# EasyEDA Pro project ProPrj_LowFreqInverter_2025-11-08.epro

# Schematic Schematic1
Board Name: Board1; Create Date: 2025-08-09; Page Name: P1; Project Name: LowFreqInverter; Schematic Name: Schematic1; Update Date: 2025-08-09; Company: Vijay Satheesh; Page Size: A4; Version: V1.0
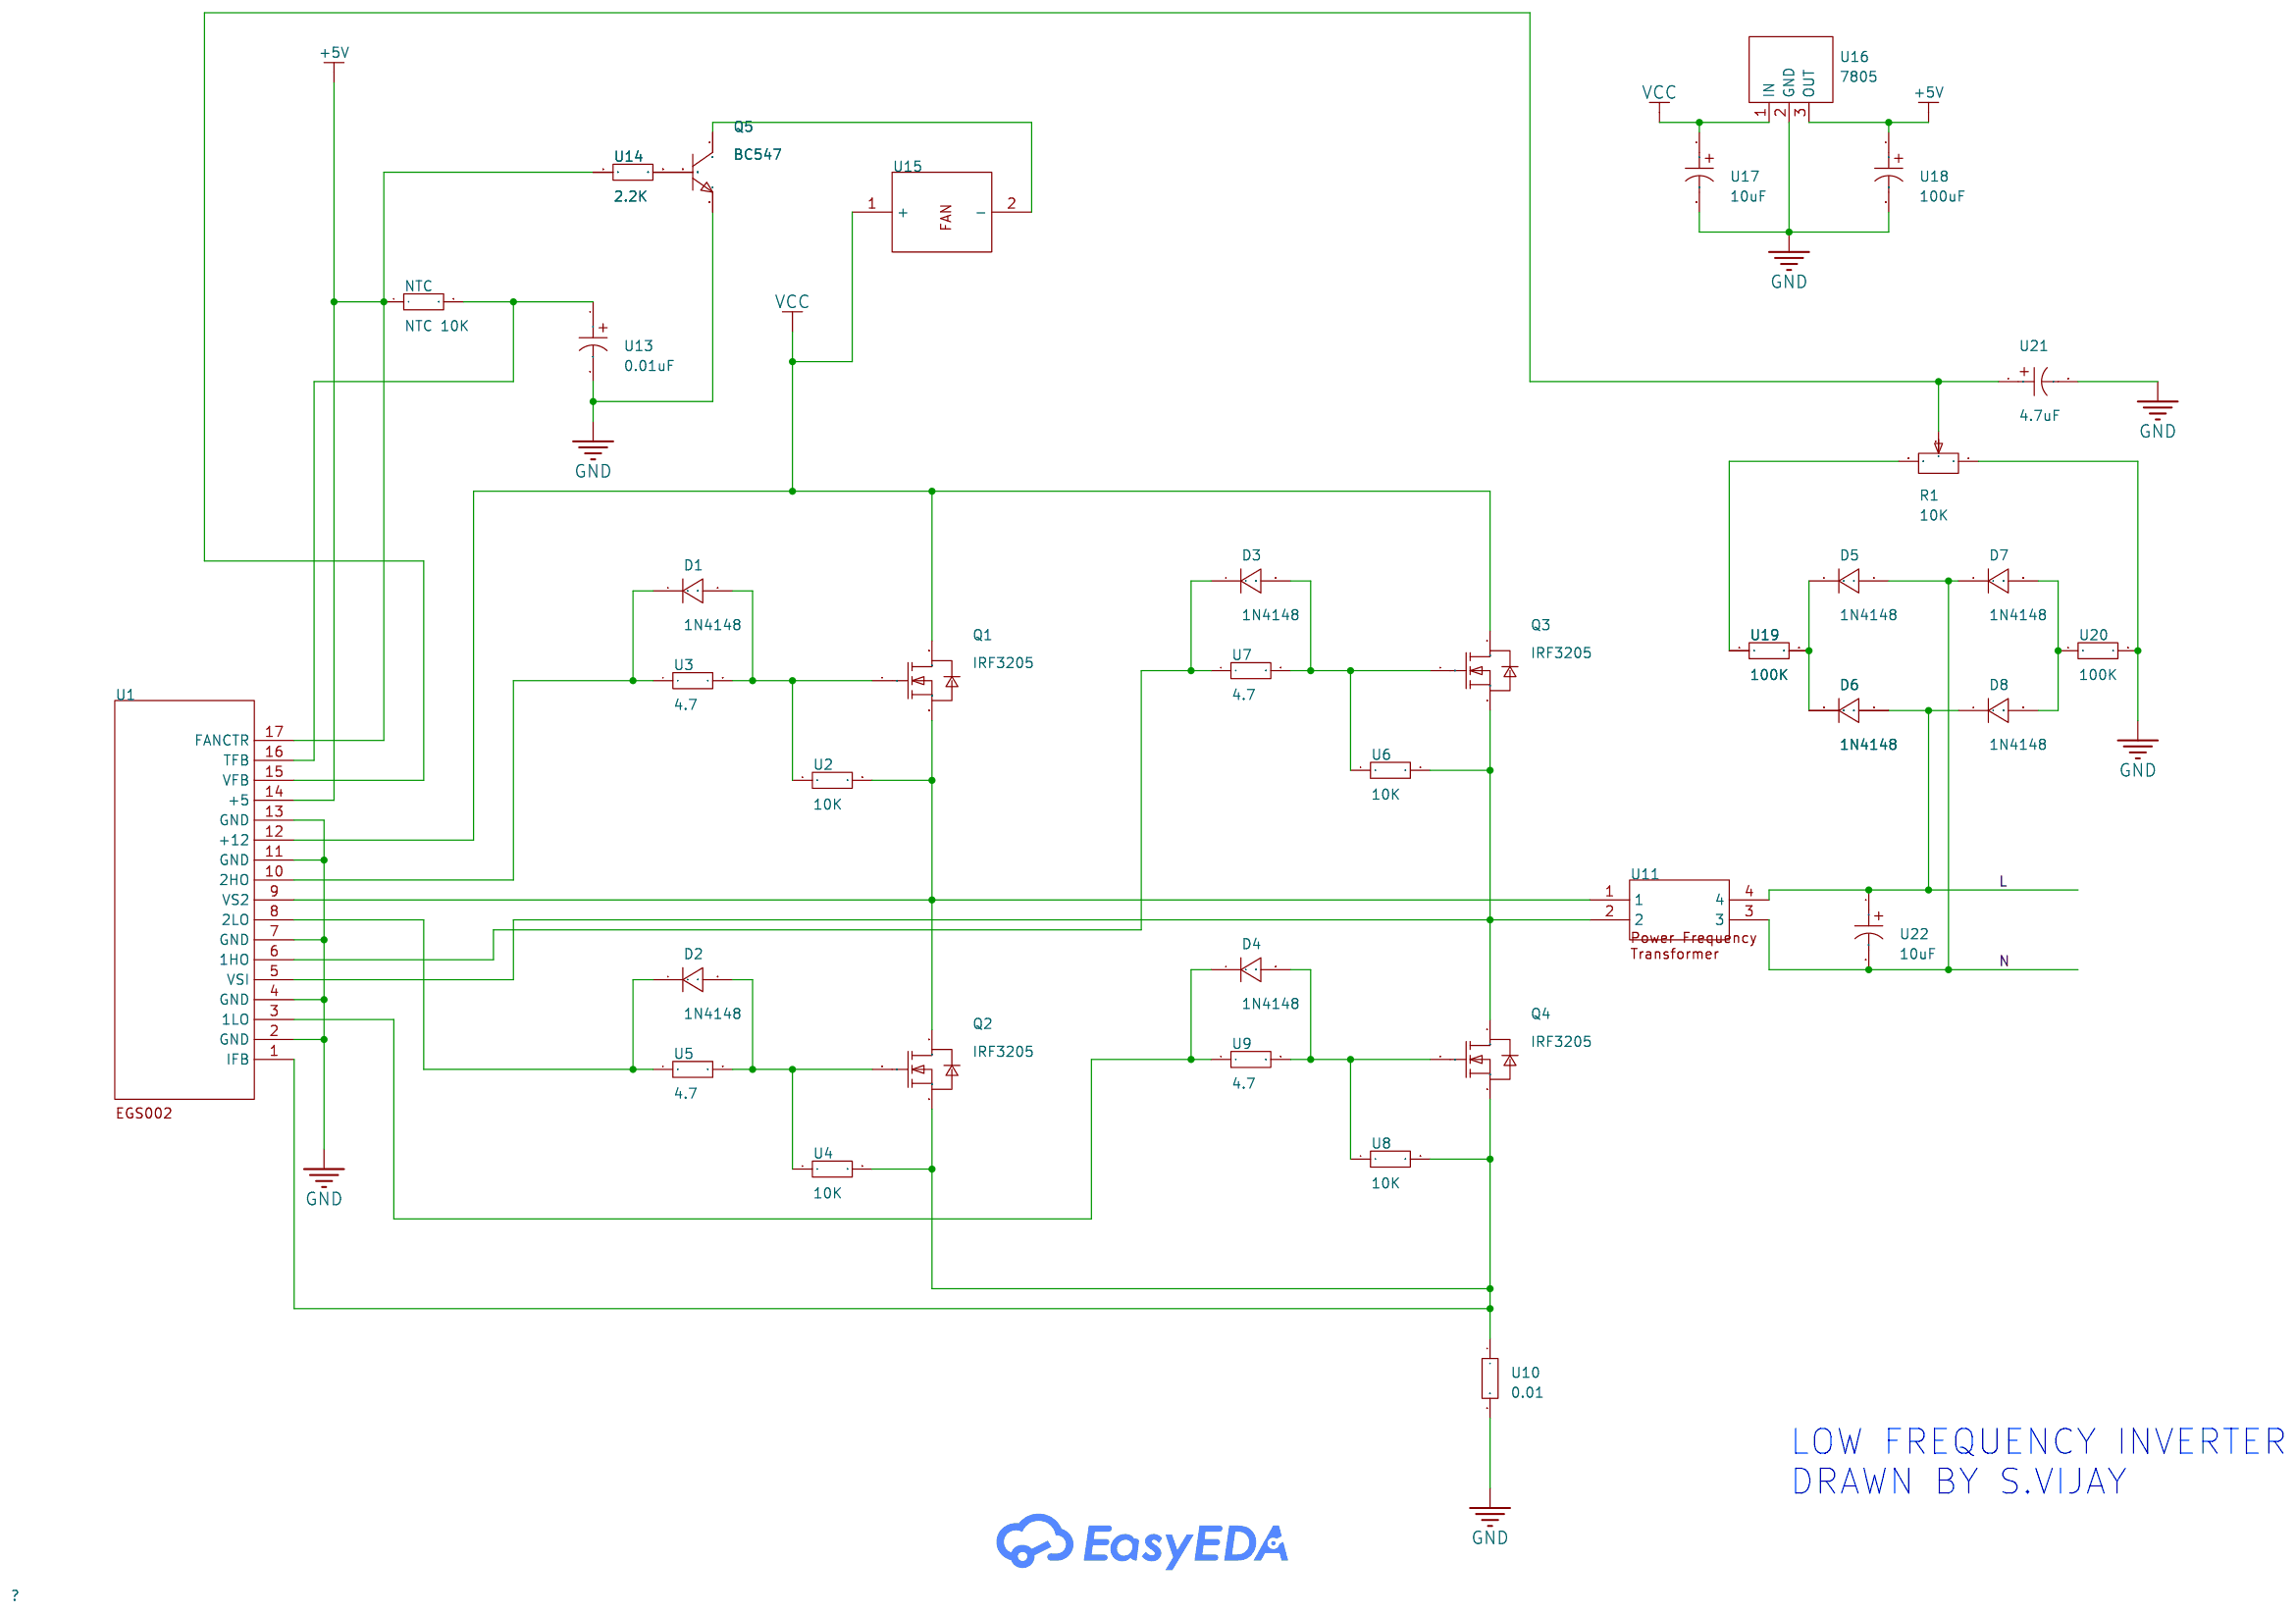
[diagram p0: schematic sheet]

## Parts
D1  1N4148  [DO-35_BD2.0-L4.0-P8.0-D0.5-RD]
D2  1N4148  [DO-35_BD2.0-L4.0-P8.0-D0.5-RD]
D3  1N4148  [DO-35_BD2.0-L4.0-P8.0-D0.5-RD]
D4  1N4148  [DO-35_BD2.0-L4.0-P8.0-D0.5-RD]
D5  1N4148  [DO-35_BD2.0-L4.0-P8.0-D0.5-RD]
D6  1N4148  [DO-35_BD2.0-L4.0-P8.0-D0.5-RD]
D7  1N4148  [DO-35_BD2.0-L4.0-P8.0-D0.5-RD]
D8  1N4148  [DO-35_BD2.0-L4.0-P8.0-D0.5-RD]
NTC  NTC 10K  [RES-TH_BD2.3-L6.5-P10.50-D0.5]
Q1  IRF3205  [TO-220-3_L10.0-W4.6-P2.54-L]
Q2  IRF3205  [TO-220-3_L10.0-W4.6-P2.54-L]
Q3  IRF3205  [TO-220-3_L10.0-W4.6-P2.54-L]
Q4  IRF3205  [TO-220-3_L10.0-W4.6-P2.54-L]
Q5  BC547  [TO-92-3_L4.9-W3.7-P1.27-L]
R1  10K  [RES-ADJ-TH_3296W]
U1  -  [EGS002]
U2  10K  [RES-TH_BD2.3-L6.5-P10.50-D0.5]
U3  4.7  [RES-TH_BD2.3-L6.5-P10.50-D0.5]
U4  10K  [RES-TH_BD2.3-L6.5-P10.50-D0.5]
U5  4.7  [RES-TH_BD2.3-L6.5-P10.50-D0.5]
U6  10K  [RES-TH_BD2.3-L6.5-P10.50-D0.5]
U7  4.7  [RES-TH_BD2.3-L6.5-P10.50-D0.5]
U8  10K  [RES-TH_BD2.3-L6.5-P10.50-D0.5]
U9  4.7  [RES-TH_BD2.3-L6.5-P10.50-D0.5]
U10  0.01  [RES-TH_BD2.3-L6.5-P10.50-D0.5]
U11  -  [Power Frequency Transformer]
U13  0.01uF  [CAP-TH_BD5.0-P2.00-D0.6-FD]
U14  2.2K  [RES-TH_BD2.3-L6.5-P10.50-D0.5]
U15  -  [FAN]
U16  7805  [TO-220-3_L10.2-W4.5-P2.54-L]
U17  10uF  [CAP-TH_BD5.0-P2.00-D0.6-FD]
U18  100uF  [CAP-TH_BD5.0-P2.00-D0.6-FD]
U19  100K  [RES-TH_BD2.3-L6.5-P10.50-D0.5]
U20  100K  [RES-TH_BD2.3-L6.5-P10.50-D0.5]
U21  4.7uF  [CAP-TH_BD5.0-P2.00-D0.6-FD]
U22  10uF  [CAP-TH_BD5.0-P2.00-D0.6-FD]

## Library data of the parts
D1-D8 = 1N4148: Diode Configuration: Forward Voltage (Vf@If):- Reverse Voltage (Vr):- Average Rectified Current (Io):- Reverse Leakage Current:-; Supplier Part: C13769; Supplier Footprint: DO-35; JLCPCB Part Class: Extended Part; Supplier: LCSC
NTC U2-U10 U14 U19 U20 = RES1/4W47K: Supplier Part: C9900002914; Supplier Footprint: RES-TH; JLCPCB Part Class: Extended Part; Supplier: LCSC
Q1-Q4 = IRF3205: Type:1 N-channel Drain to Source Voltage:55V Current - Continuous Drain(Id):110A RDS(on):7.2mΩ@10V,40A Pd - Power Dissipation:210W Gate Threshold Voltage (Vgs(th)@Id):4V Gate Charge(Qg):146nC@10V Input Capacitance(Ciss@Vds):3.247nF@25V Reverse Transfer Ca; LCSC Part Name: 1个N沟道 耐压:55V 电流:110A; Supplier Part: C19189952; Manufacturer: minos(迈诺斯); Supplier Footprint: TO-220; Datasheet: https://atta.szlcsc.com/upload/public/pdf/source/20231108/C93D91AA19AF5D739BAF624DC44DB8C4.pdf; Supplier: LCSC; Type: 1 N-channel; Drain to Source Voltage: 55V; Current - Continuous Drain(Id): 110A; RDS(on): 7.2mΩ@10V,40A; Pd - Power Dissipation: 210W; Gate Threshold Voltage (Vgs(th)@Id): 4V; Gate Charge(Qg): 146nC@10V; Input Capacitance(Ciss@Vds): 3.247nF@25V; Reverse Transfer Capacitance (Crss@Vds): 211pF@25V; Operating Temperature: -55℃~+175℃
Q5 = BC547: type:NPN Current - Collector(Ic):100mA Collector - Emitter Voltage VCEO:45V Pd - Power Dissipation:625mW DC Current Gain:800@5V,2mA DC Current Gain:800@5V,2mA Transition frequency(fT):150MHz Current - Collector Cutoff:100nA Vce Saturation(VCE(sat)):300mV@; Supplier Part: C47089404; Manufacturer: CJ(江苏长电/长晶); Supplier Footprint: TO-92; JLCPCB Part Class: Extended Part; Datasheet: https://atta.szlcsc.com/upload/public/pdf/source/20250402/F61E63731C76602D8AF3C7B55B416117.pdf; Supplier: LCSC; type: NPN; Current - Collector(Ic): 100mA; Collector - Emitter Voltage VCEO: 45V; Pd - Power Dissipation: 625mW; DC Current Gain: 800@5V,2mA; Transition frequency(fT): 150MHz; Current - Collector Cutoff: 100nA; Vce Saturation(VCE(sat)): 300mV@100mA,5mA; Operating Temperature: -55℃~+150℃; Emitter-Base Voltage(Vebo): 6V; Number: 1 NPN
R1 = 3296W-2K: Supplier Part: C9900022608; Supplier Footprint: RES-ADJ-TH; JLCPCB Part Class: Extended Part; Supplier: LCSC
U1 = EGS002
U11 = Power Frequency Transformer
U13 U17 U18 U21 U22 = CE2.5MM-4.7uf 50V: Supplier Part: C9900010368; Supplier Footprint: CAP-TH; JLCPCB Part Class: Extended Part; Supplier: LCSC
U15 = FAN
U16 = 7805: Supplier Part: C2941265; Supplier Footprint: TO-220; Supplier: LCSC

## Nets
+5V: NTC.1 U1.14(+5) U1.17(FANCTR) U14.1 U16.3(OUT) U18.1
GND: Q5.3(E) R1.1 U1.2(GND) U1.4(GND) U1.7(GND) U1.11(GND) U1.13(GND) U10.2 U13.2 U16.2(GND) U17.2 U18.2 U20.2 U21.2
VCC: Q1.2(D) Q3.2(D) U1.12(+12) U15.1(+) U16.1(IN) U17.1
L: D6.2 D8.1 U11.4 U22.1
N: D5.2 D7.1 U11.3 U22.2
$1N413: D1.2 Q1.1(G) U2.1 U3.2
$1N428: D1.1 U1.10(2HO) U3.1
$1N449: Q1.3(S) Q2.2(D) U1.9(VS2) U2.2 U11.1
$1N596: D2.2 Q2.1(G) U4.1 U5.2
$1N603: D2.1 U1.8(2LO) U5.1
$1N750: D3.2 Q3.1(G) U6.1 U7.2
$1N757: D3.1 U1.6(1HO) U7.1
$1N761: Q3.3(S) Q4.2(D) U1.5(VSI) U6.2 U11.2
$1N904: D4.2 Q4.1(G) U8.1 U9.2
$1N911: D4.1 U1.3(1LO) U9.1
$1N915: Q2.3(S) Q4.3(S) U1.1(IFB) U4.2 U8.2 U10.1
$1N1323: NTC.2 U1.16(TFB) U13.1
$1N1552: Q5.2(B) U14.2
$1N1627: Q5.1(C) U15.2(-)
$1N2099: D5.1 D6.1 U19.2
$1N2104: D7.2 D8.2 U20.1
$1N2266: R1.3 U19.1
$1N2327: R1.2 U1.15(VFB) U21.1

## Notes on the sheet
- LOW FREQUENCY INVERTER
  DRAWN BY S.VIJAY

# Board PCB4
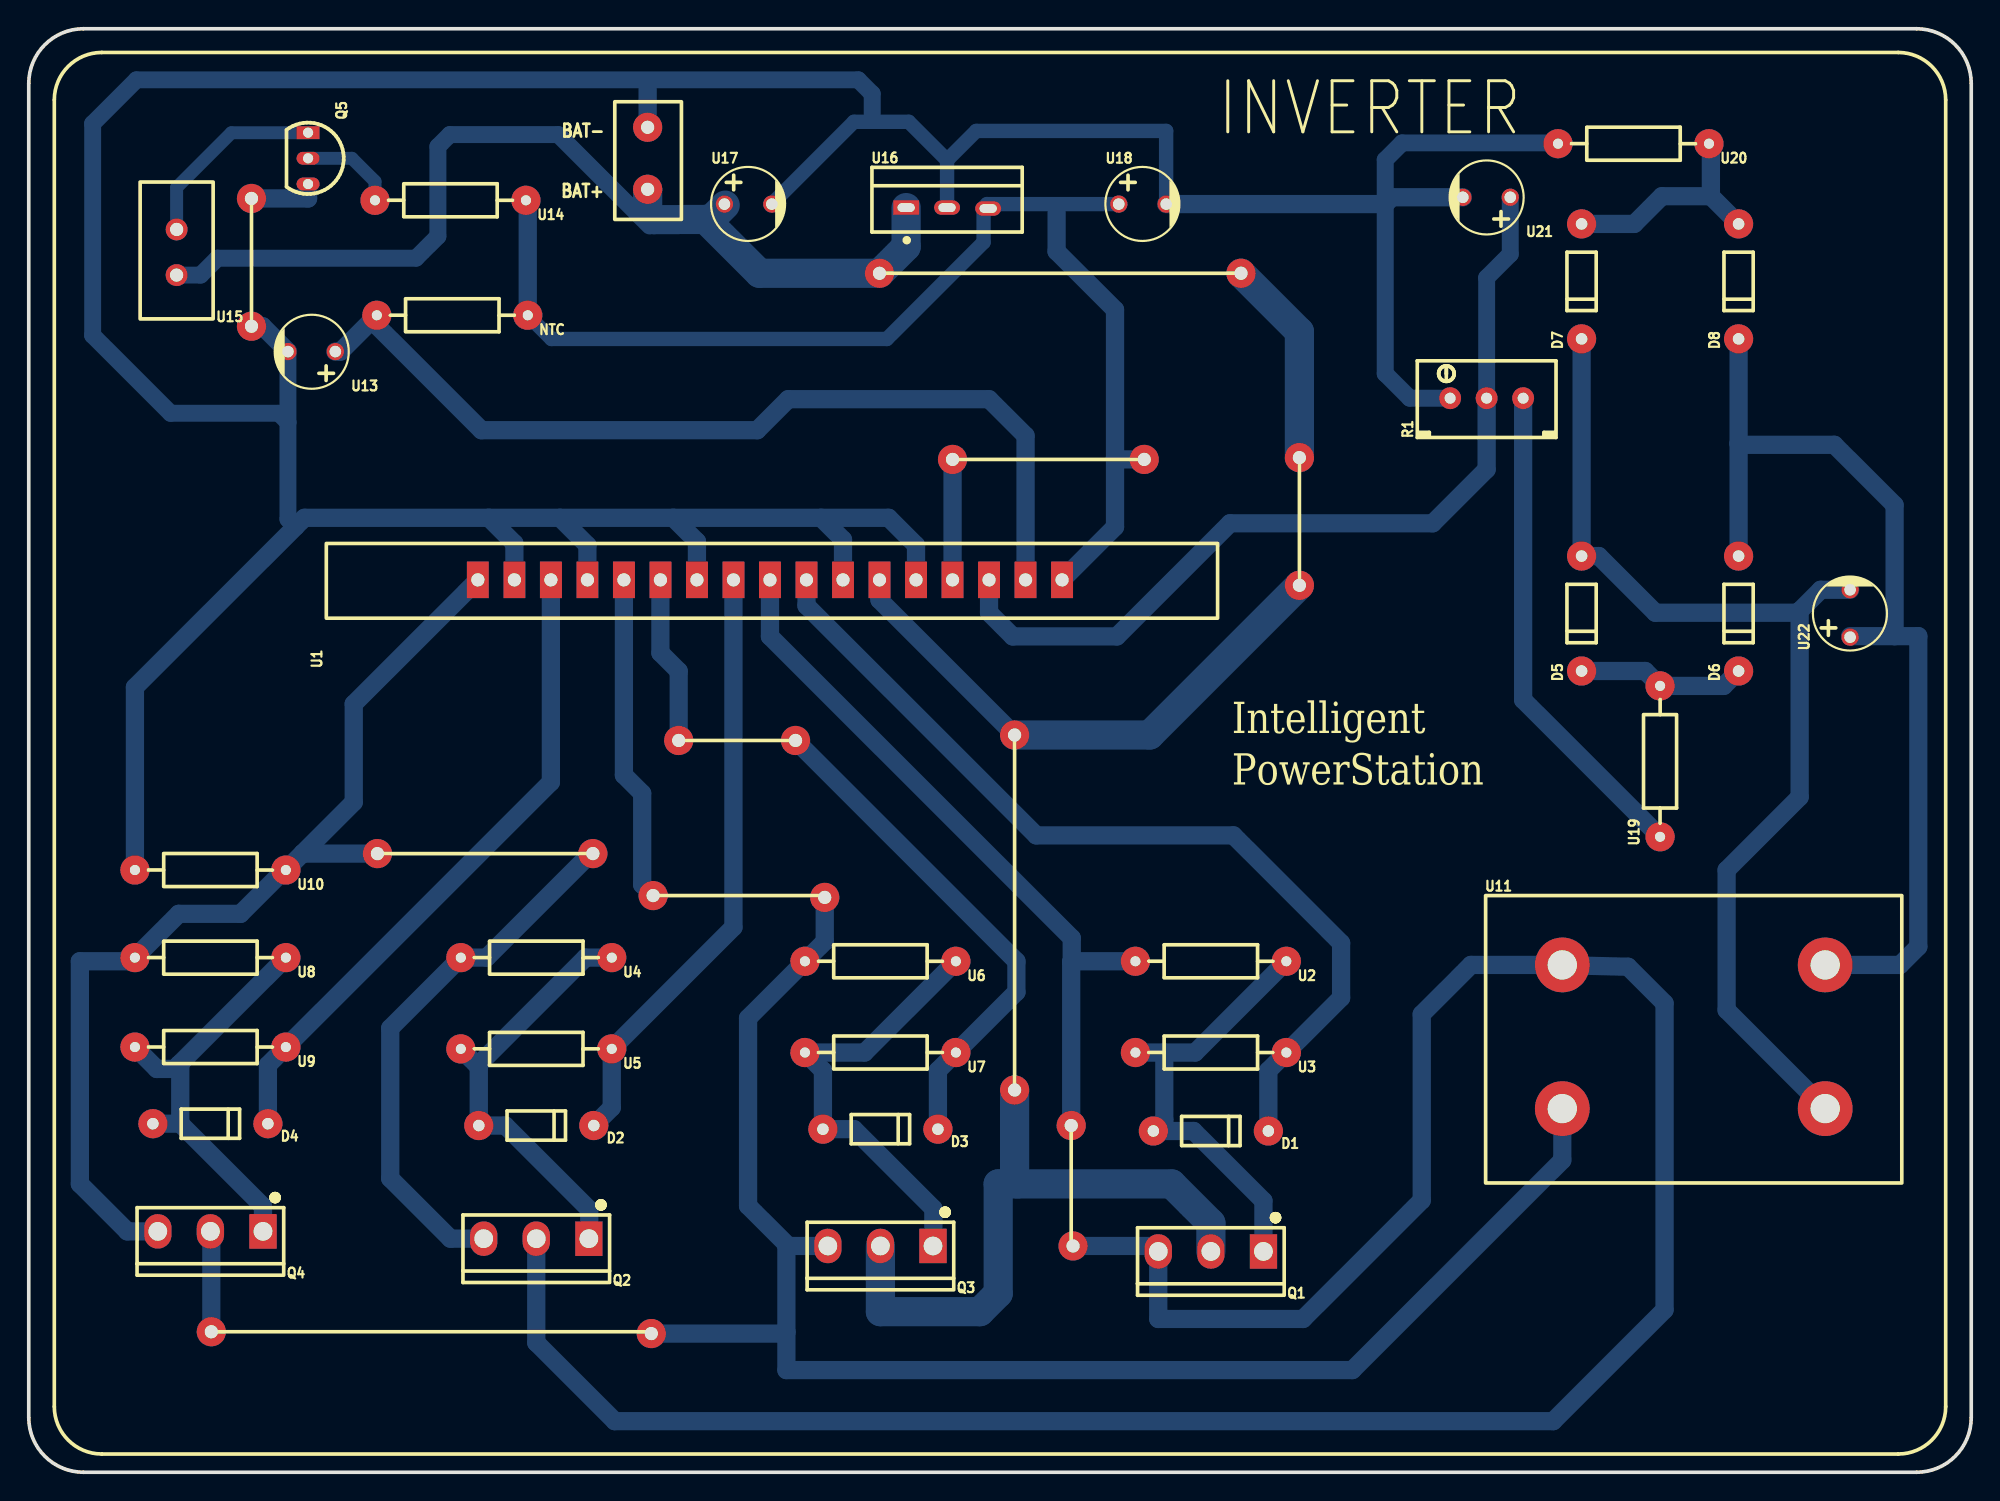
[diagram p1: board, top side]
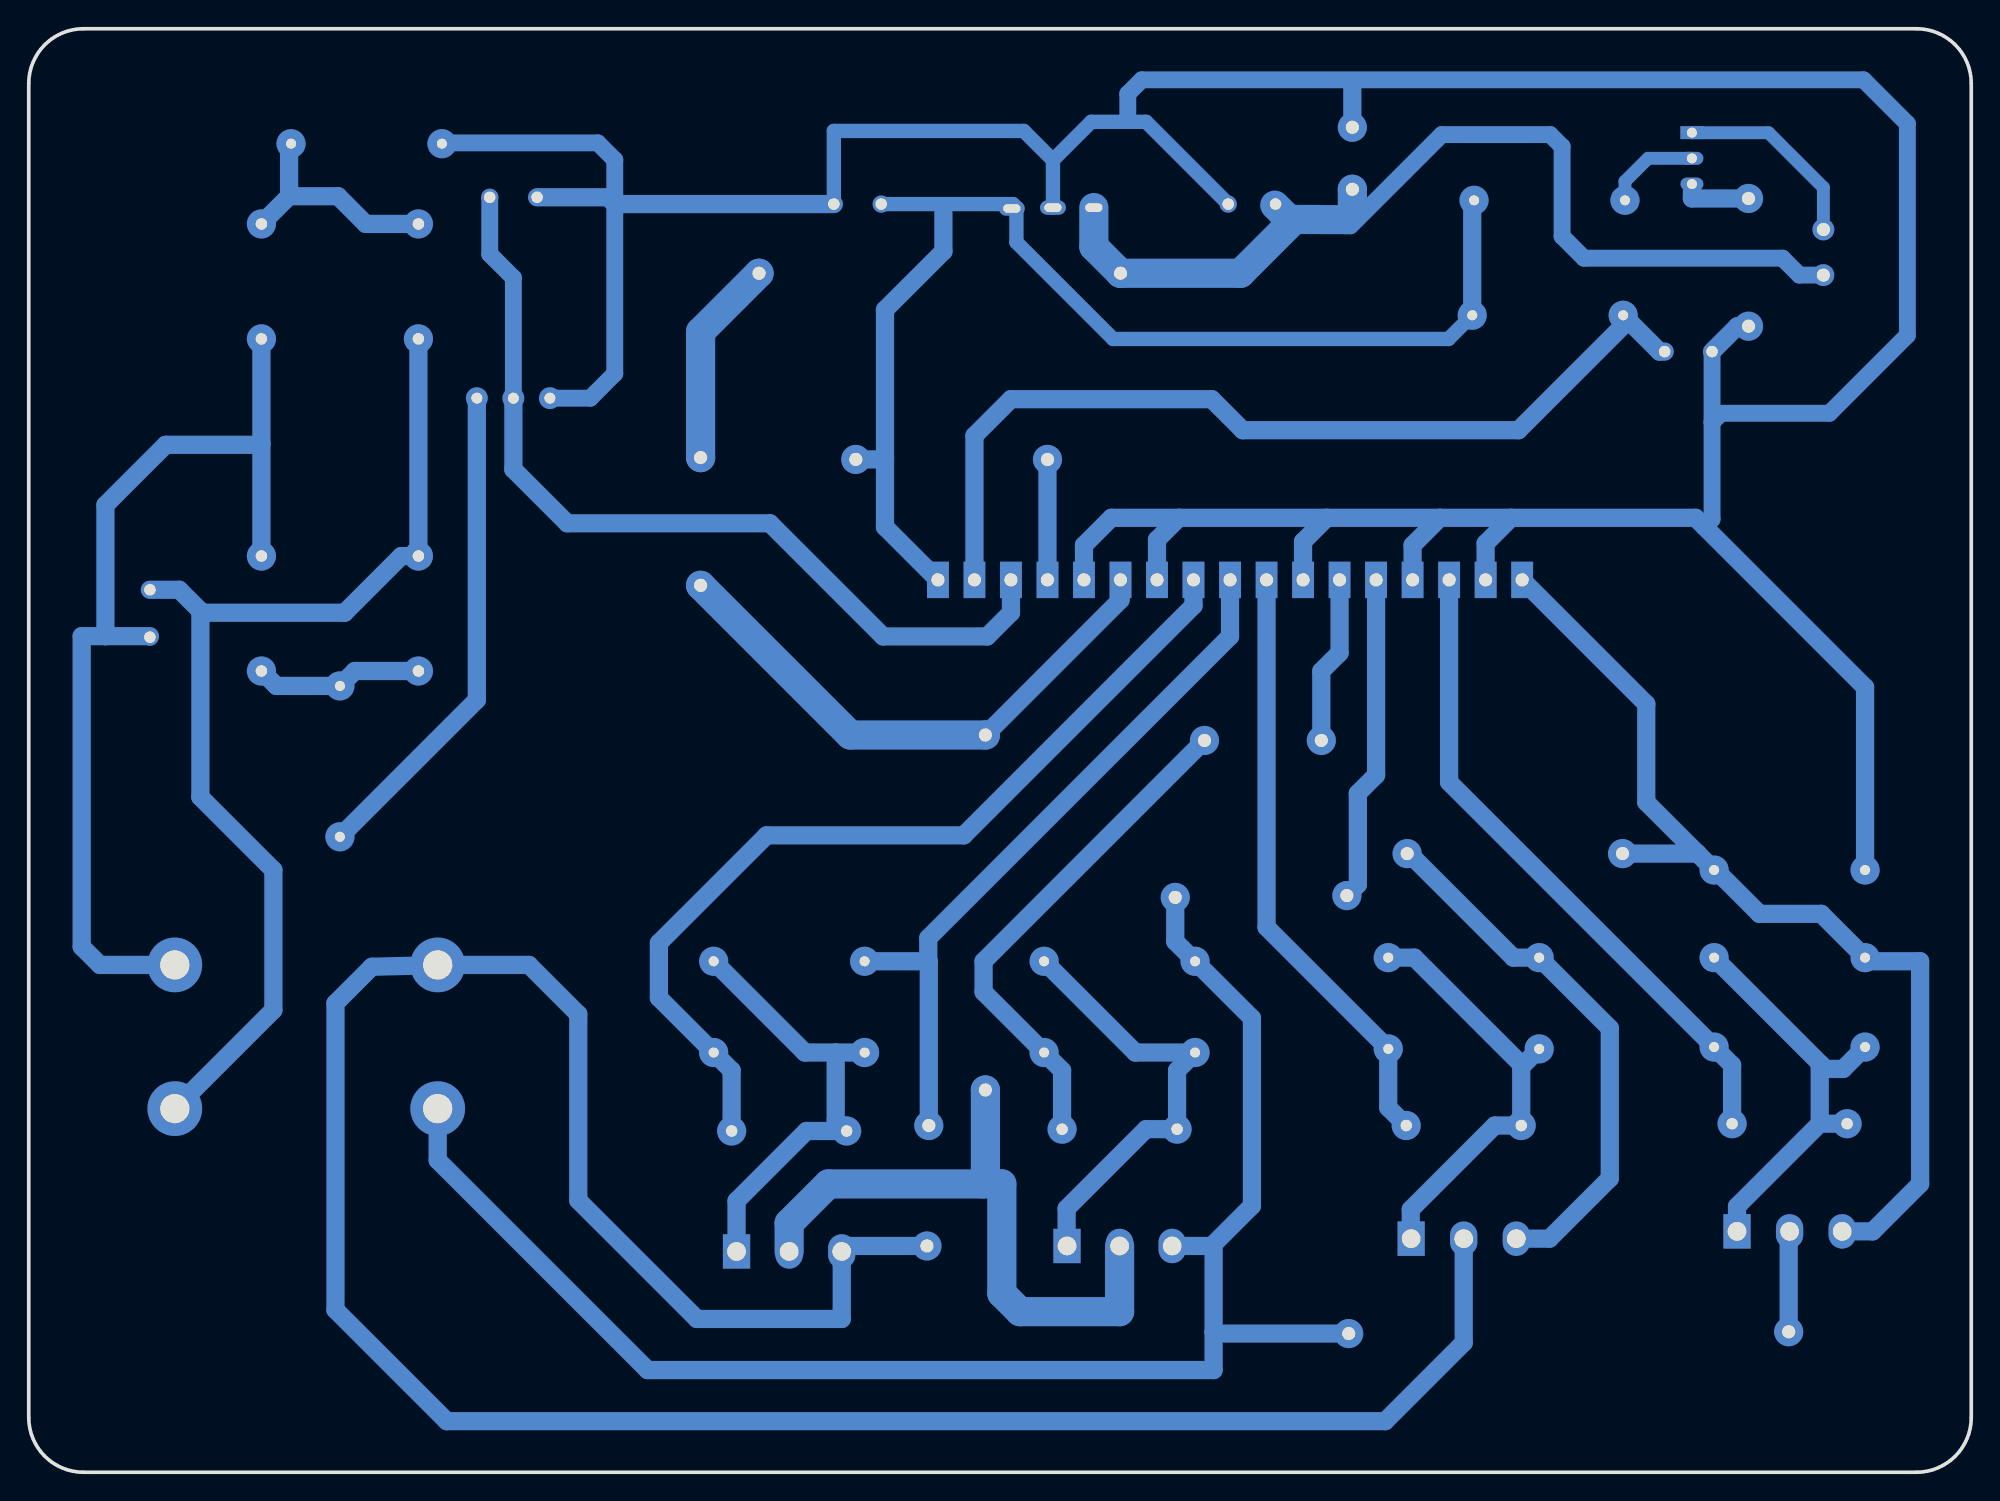
[diagram p2: board, bottom side, seen from below]

Outline 135.13 x 100.46 mm; copper layers: Top Layer, Bottom Layer. Coordinates in mm from the lower left corner of the outline.
Outline path: 0,96.65 0,3.81 arc(1.12,1.12) 3.81,0 131.32,0 arc(134.01,1.12) 135.13,3.81 135.13,96.65 arc(134.01,99.34) 131.32,100.46 3.81,100.46 arc(1.12,99.34) 0,96.65
Stack: Top Layer 0.035mm / Dielectric1 1.51mm FR4 er 4.5 / Bottom Layer 0.035mm

## Design rules (mm)
template: Custom Config
spacing copperThickness1oz (default): track to track 0.102, other pairs 0.152 to 0.3
spacing copperThickness2oz: track to track 0.203, other pairs 0.152 to 0.3
track width copperThickness1oz (default): min 1.27, default 1.27, max 1.524
track width copperThickness2oz: min 0.203, default 0.254, max 2.54
differential pair differentialPair (default): width min 0.127, default 0.254, max 2.54; gap min 0.152, default 0.152
via viaSize (default): diameter min 0.5, default 0.61, max 10; hole min 0.3, default 0.305, max 6.3

## Placement (name value [footprint] x y rotation side)
D1  1N4148  [DO-35_BD2.0-L4.0-P8.0-D0.5-RD]  82.23 23.75 180 top
D2  1N4148  [DO-35_BD2.0-L4.0-P8.0-D0.5-RD]  35.31 24.13 180 top
D3  1N4148  [DO-35_BD2.0-L4.0-P8.0-D0.5-RD]  59.25 23.88 180 top
D4  1N4148  [DO-35_BD2.0-L4.0-P8.0-D0.5-RD]  12.64 24.26 180 top
D5  1N4148  [DO-35_BD2.0-L4.0-P8.0-D0.5-RD]  108.02 59.76 90 top
D6  1N4148  [DO-35_BD2.0-L4.0-P8.0-D0.5-RD]  118.94 59.76 90 top
D7  1N4148  [DO-35_BD2.0-L4.0-P8.0-D0.5-RD]  108.02 82.87 90 top
D8  1N4148  [DO-35_BD2.0-L4.0-P8.0-D0.5-RD]  118.94 82.87 90 top
NOREF  -  [Pad_e31981]  12.7 9.78 0 top
NOREF#2  -  [Pad_e31996]  24.26 43.05 0 top
NOREF#3  -  [Pad_e32066]  53.34 50.93 0 top
NOREF#4  -  [Pad_e31968]  68.58 26.6 0 top
NOREF#5  -  [Pad_e31997]  39.24 43.05 0 top
NOREF#6  -  [Pad_e73]  43.05 93.6 0 top
NOREF#7  -  [Pad_e31954]  72.52 24.13 0 top
NOREF#8  -  [Pad_e32067]  45.21 50.93 0 top
NOREF#9  -  [Pad_e31955]  72.64 15.75 0 top
NOREF#10  -  [Pad_e32011]  43.43 40.13 0 top
NOREF#11  -  [Pad_e32399]  84.33 83.44 0 top
NOREF#12  -  [Pad_e31967]  68.58 51.31 0 top
NOREF#13  -  [Pad_e32398]  59.18 83.44 0 top
NOREF#14  -  [Pad_e74]  43.05 89.28 0 top
NOREF#15  -  [Pad_e32167]  15.49 88.65 0 top
NOREF#16  -  [Pad_e32168]  15.49 79.76 0 top
NOREF#17  -  [Pad_e32022]  64.26 70.48 0 top
NOREF#18  -  [Pad_e32393]  88.39 70.61 0 top
NOREF#19  -  [Pad_e32023]  77.6 70.48 0 top
NOREF#20  -  [Pad_e32012]  55.37 40.01 0 top
NOREF#21  -  [Pad_e32394]  88.39 61.72 0 top
NOREF#22  -  [Pad_e31980]  43.31 9.65 0 top
NTC  NTC 10K  [RES-TH_BD2.3-L6.5-P10.50-D0.5]  29.46 80.52 180 top
Q1  IRF3205  [TO-220-3_L10.0-W4.6-P2.54-L]  82.23 15.37 180 top
Q2  IRF3205  [TO-220-3_L10.0-W4.6-P2.54-L]  35.31 16.26 180 top
Q3  IRF3205  [TO-220-3_L10.0-W4.6-P2.54-L]  59.25 15.75 180 top
Q4  IRF3205  [TO-220-3_L10.0-W4.6-P2.54-L]  12.64 16.76 180 top
Q5  BC547  [TO-92-3_L4.9-W3.7-P1.27-L]  19.43 91.44 270 top
R1  10K  [RES-ADJ-TH_3296W]  101.42 74.75 90 top
U1  -  [EGS002]  20.45 59.31 90 top
U2  10K  [RES-TH_BD2.3-L6.5-P10.50-D0.5]  82.23 35.56 180 top
U3  4.7  [RES-TH_BD2.3-L6.5-P10.50-D0.5]  82.23 29.21 180 top
U4  10K  [RES-TH_BD2.3-L6.5-P10.50-D0.5]  35.31 35.81 180 top
U5  4.7  [RES-TH_BD2.3-L6.5-P10.50-D0.5]  35.31 29.46 180 top
U6  10K  [RES-TH_BD2.3-L6.5-P10.50-D0.5]  59.25 35.56 180 top
U7  4.7  [RES-TH_BD2.3-L6.5-P10.50-D0.5]  59.25 29.21 180 top
U8  10K  [RES-TH_BD2.3-L6.5-P10.50-D0.5]  12.64 35.81 180 top
U9  4.7  [RES-TH_BD2.3-L6.5-P10.50-D0.5]  12.64 29.59 180 top
U10  0.01  [RES-TH_BD2.3-L6.5-P10.50-D0.5]  12.64 41.91 180 top
U11  -  [Power Frequency Transformer]  101.22 40.26 0 top
U13  0.01uF  [CAP-TH_BD5.0-P2.00-D0.6-FD]  19.68 77.98 180 top
U14  2.2K  [RES-TH_BD2.3-L6.5-P10.50-D0.5]  29.34 88.52 180 top
U15  -  [FAN]  12.95 80.01 180 top
U16  7805  [TO-220-3_L10.2-W4.5-P2.54-L]  63.88 88.01 0 top
U17  10uF  [CAP-TH_BD5.0-P2.00-D0.6-FD]  50.04 88.27 0 top
U18  100uF  [CAP-TH_BD5.0-P2.00-D0.6-FD]  77.47 88.27 0 top
U19  100K  [RES-TH_BD2.3-L6.5-P10.50-D0.5]  113.48 49.47 90 top
U20  100K  [RES-TH_BD2.3-L6.5-P10.50-D0.5]  111.63 92.46 180 top
U21  4.7uF  [CAP-TH_BD5.0-P2.00-D0.6-FD]  101.42 88.72 180 top
U22  10uF  [CAP-TH_BD5.0-P2.00-D0.6-FD]  126.69 59.76 90 top

## Footprints (pads in the part's own frame, mm; a bottom-side part is the same pattern mirrored in y, then rotated)
CAP-TH_BD5.0-P2.00-D0.6-FD
  round 1.202 hole 0.801: 1(-1.643,-0.011) 2(1.654,-0.011)
DO-35_BD2.0-L4.0-P8.0-D0.5-RD
  round 2.032 hole 0.8: 1(-4,0) 2(4,0)
EGS002
  rect 2.54x1.524 hole 0.914: 1(2.794,-10.795) 2(2.794,-13.335) 3(2.794,-15.875) 4(2.794,-18.415) 5(2.794,-20.955) 6(2.794,-23.495) 7(2.794,-26.035) 8(2.794,-28.575) 9(2.794,-31.115) 10(2.794,-33.655) 11(2.794,-36.195) 12(2.794,-38.735) 13(2.794,-41.275) 14(2.794,-43.815) 15(2.794,-46.355) 16(2.794,-48.895) 17(2.794,-51.435)
FAN
  round 1.524 hole 0.914: 1(2.667,-3.302) 2(2.667,-6.477)
Pad_e73
  round 2.032 hole 0.914: 2(0,0)
Pad_e74
  round 2.032 hole 0.914: 2(0,0)
Pad_e31954
  round 2.032 hole 0.914: 1(0,0)
Pad_e31955
  round 2.032 hole 0.914: 2(0,0)
Pad_e31967
  round 2.032 hole 0.914: 1(0,0)
Pad_e31968
  round 2.032 hole 0.914: 2(0,0)
Pad_e31980
  round 2.032 hole 0.914: 1(0,0)
Pad_e31981
  round 2.032 hole 0.914: 2(0,0)
Pad_e31996
  round 2.032 hole 0.914: 1(0,0)
Pad_e31997
  round 2.032 hole 0.914: 2(0,0)
Pad_e32011
  round 2.032 hole 0.914: 1(0,0)
Pad_e32012
  round 2.032 hole 0.914: 2(0,0)
Pad_e32022
  round 2.032 hole 0.914: 1(0,0)
Pad_e32023
  round 2.032 hole 0.914: 2(0,0)
Pad_e32066
  round 2.032 hole 0.914: 1(0,0)
Pad_e32067
  round 2.032 hole 0.914: 2(0,0)
Pad_e32167
  round 2.032 hole 0.914: 1(0,0)
Pad_e32168
  round 2.032 hole 0.914: 2(0,0)
Pad_e32393
  round 2.032 hole 0.914: 1(0,0)
Pad_e32394
  round 2.032 hole 0.914: 2(0,0)
Pad_e32398
  round 2.032 hole 0.914: 1(0,0)
Pad_e32399
  round 2.032 hole 0.914: 2(0,0)
Power Frequency Transformer
  round 3.81 hole 2.032: 1(5.461,-4.953) 2(5.461,-14.953) 3(23.749,-14.953) 4(23.749,-4.953)
RES-ADJ-TH_3296W
  round 1.524 hole 0.762: 1(0,2.54) 2(0,0) 3(0,-2.54)
RES-TH_BD2.3-L6.5-P10.50-D0.5
  round 2.032 hole 0.7: 1(-5.25,0) 2(5.25,0)
TO-92-3_L4.9-W3.7-P1.27-L
  rect 0.9x1.6 hole 0.7: 1(-1.786,0)
  oval 0.9x1.6 hole 0.7: 2(0,0) 3(1.79,0)
TO-220-3_L10.0-W4.6-P2.54-L
  rect 1.9x2.4 hole 1.3: 1(-3.658,0)
  oval 1.9x2.4 hole 1.3: 2(0,0) 3(3.658,0)
TO-220-3_L10.2-W4.5-P2.54-L
  rect 1.8x1 hole 1.2x0.6: 1(-2.846,0)
  oval 1.8x1 hole 1.2x0.6: 2(0,0) 3(2.858,-0.064)

## Nets
+5V: NOREF#17.1 NOREF#19.2 NTC.1 U1.14 U1.17 U14.1 U16.3 U18.1
GND: NOREF#6.2 NOREF#15.1 NOREF#16.2 Q5.3 R1.1 U1.2 U1.4 U1.7 U1.11 U1.13 U10.2 U13.2 U16.2 U17.2 U18.2 U20.2 U21.2
VCC: NOREF#4.2 NOREF#11.2 NOREF#12.1 NOREF#13.1 NOREF#14.2 NOREF#18.1 NOREF#21.2 Q1.2 Q3.2 U1.12 U15.1 U16.1 U17.1
L: D6.2 D8.1 U11.4 U22.1
N: D5.2 D7.1 U11.3 U22.2
$1N413: D1.2 Q1.1 U2.1 U3.2
$1N428: D1.1 U1.10 U3.1
$1N449: NOREF#7.1 NOREF#9.2 Q1.3 Q2.2 U1.9 U2.2 U11.1
$1N596: D2.2 Q2.1 U4.1 U5.2
$1N603: D2.1 U1.8 U5.1
$1N750: D3.2 Q3.1 U6.1 U7.2
$1N757: D3.1 NOREF#3.1 NOREF#8.2 U1.6 U7.1
$1N761: NOREF.2 NOREF#10.1 NOREF#20.2 NOREF#22.1 Q3.3 Q4.2 U1.5 U6.2 U11.2
$1N904: D4.2 Q4.1 U8.1 U9.2
$1N911: D4.1 U1.3 U9.1
$1N915: NOREF#2.1 NOREF#5.2 Q2.3 Q4.3 U1.1 U4.2 U8.2 U10.1
$1N1323: NTC.2 U1.16 U13.1
$1N1552: Q5.2 U14.2
$1N1627: Q5.1 U15.2
$1N2099: D5.1 D6.1 U19.2
$1N2104: D7.2 D8.2 U20.1
$1N2266: R1.3 U19.1
$1N2327: R1.2 U1.15 U21.1

## Routing (per net, layer and track width the routed paths; a pad name or vN(x,y) marks a point on that pad's centre or on a via; arc(x,y) is an arc through that point)
+5V: length 94.4
  Bottom Layer w1: U18.1 66.66,88.25 66.42,88.01 66.42,85.6 59.69,78.87 36.36,78.87 NTC.1
  Bottom Layer w1.27: U14.1 34.71,88.39 NTC.1 ; 71.88,62.1 75.56,65.79 75.56,70.62 ; 64.26,62.1 NOREF#17.1 ; NOREF#19.2 75.7,70.48 75.56,70.62 ; 71.5,87.63 71.5,84.96 75.56,80.9 75.56,70.62
GND: length 300.3
  Bottom Layer w1: 63.88,91.31 65.91,93.34 79.12,93.34 79.12,88.26 U18.2 ; 63.88,91.31 61.21,93.98 57.4,93.98 51.69,88.27 ; 63.88,91.31 U16.2
  Bottom Layer w1.177: 18.03,73.06 18.03,66.33 18.56,65.8 ; 18.03,73.06 17.4,73.7 9.87,73.7 4.44,79.12 4.44,93.85 7.49,96.9 57.7,96.9 58.67,95.93 58.67,94.23 ; 18.03,73.06 U13.2 ; U20.2 106.33,92.51 95.54,92.51 94.36,91.34 94.36,88.27 ; 94.36,88.25 94.36,76.45 96.07,74.75 R1.1
  Bottom Layer w1.27: 44.83,66.42 46.48,64.77 46.48,62.1 ; 44.83,66.42 55.12,66.42 ; 44.83,66.42 36.96,66.42 ; 38.86,62.1 38.86,64.52 36.96,66.42 ; 61.72,62.1 61.72,64.52 59.82,66.42 55.12,66.42 ; 55.12,66.42 56.64,64.9 56.64,62.1 ; U10.2 7.39,54.63 19.18,66.42 32,66.42 ; NOREF#15.1 19.43,88.65 19.43,89.14 ; NOREF#6.2 43.05,96.52 ; U13.2 16.26,79.76 NOREF#16.2 ; 36.96,66.42 32,66.42 ; U21.2 94.83,88.73 94.36,88.25 94.34,88.25 ; 32,66.42 33.78,64.64 33.78,62.1 ; 94.34,88.25 94.36,88.27 ; 94.34,88.25 U18.2
VCC: length 168.4
  Bottom Layer w1.177: 43.19,86.73 36.83,93.09 29.29,93.09 28.46,92.26 28.46,86.01 26.94,84.49 13.13,84.49 11.95,83.31 U15.1
  Bottom Layer w1.27: 68.58,20.27 68.78,20.07 ; NOREF#12.1 59.18,60.71 59.18,62.1
  Bottom Layer w2.032: U16.1 61.03,85.29 NOREF#13.1 50.83,83.44 47.09,87.19 ; NOREF#18.1 88.39,79.38 NOREF#11.2 ; 47.09,87.19 47.45,87.19 48.45,88.18 ; 47.09,87.19 45.4,87.19 ; Q3.2 59.25,11.18 66.17,11.18 67.44,12.45 67.44,20.07 79.5,20.07 82.23,17.34 Q1.2 ; NOREF#21.2 77.98,51.31 NOREF#12.1 ; 45.16,87.17 43.49,87.17 43.05,87.61 NOREF#14.2 ; NOREF#4.2 68.58,20.27
L: length 70.1
  Bottom Layer w1.27: 118.94,78.75 118.94,71.6 ; 118.94,71.6 119.04,71.5 125.6,71.5 129.79,67.31 129.79,58.19 ; 118.94,71.6 D6.2 ; 129.79,58.19 131.44,58.19 131.44,36.58 130.18,35.31 U11.4 ; 129.79,58.19 126.7,58.19
N: length 75.7
  Bottom Layer w1.27: 123.19,59.94 123.06,59.82 113.16,59.82 109.21,63.76 D5.2 D7.1 ; 123.19,59.94 124.66,61.41 U22.2 ; 123.19,59.94 123.19,46.99 118.11,41.91 118.11,32.16 U11.3
$1N413: length 32.1
  Bottom Layer w1.27: 78.99,29.21 81.13,29.21 U2.1 ; 78.99,29.21 U3.2 ; 78.99,29.21 78.99,24.51 D1.2 81.03,23.75 85.89,18.88 Q1.1
$1N428: length 63.9
  Bottom Layer w1.27: D1.1 86.23,27.96 U3.1 91.29,33.02 91.29,36.83 83.8,44.32 70.09,44.32 54.1,60.31 54.1,62.1
$1N449: length 229.1
  Bottom Layer w1.27: 72.55,35.56 72.55,37.17 51.56,58.17 51.56,62.1 ; 72.55,35.56 72.52,35.52 NOREF#7.1 ; 72.55,35.56 U2.2 ; Q2.2 35.31,9.02 40.77,3.56 106.05,3.56 113.79,11.3 113.79,32.64 111.25,35.18 106.05,35.31 ; 106.05,35.31 100.33,35.31 96.9,31.88 96.9,18.92 88.65,10.67 78.58,10.67 Q1.3 78.19,15.75 NOREF#9.2 ; 106.05,35.31 U11.1
$1N596: length 30.5
  Bottom Layer w1.27: Q2.1 38.99,16.28 38.99,18.29 33.15,24.13 D2.2 31.31,28.21 ; 31.31,28.21 31.31,28.39 38.73,35.81 U4.1 ; 31.31,28.21 U5.2
$1N603: length 42
  Bottom Layer w1.27: D2.1 40.56,25.38 U5.1 49.02,37.93 49.02,62.1
$1N750: length 31.6
  Bottom Layer w1.27: U6.1 58.15,29.21 U7.2 55.25,27.96 D3.2 57.4,23.88 62.93,18.35 62.93,15.77 Q3.1
$1N757: length 47.4
  Bottom Layer w1.27: NOREF#8.2 45.21,55.75 43.94,57.02 43.94,62.1 ; D3.1 63.25,27.96 U7.1 68.71,33.42 68.71,35.56 NOREF#3.1
$1N761: length 142
  Bottom Layer w1.27: NOREF#20.2 55.37,36.94 U6.2 50.04,31.6 50.04,18.54 52.83,15.75 ; 52.7,9.76 52.59,9.65 NOREF#22.1 ; 52.7,9.76 52.7,15.75 52.83,15.75 ; 52.7,9.76 52.7,7.11 92.08,7.11 106.68,21.72 U11.2 ; 52.83,15.75 Q3.3 ; NOREF#10.1 42.67,40.89 42.67,47.24 41.4,48.51 41.4,62.1 ; NOREF.2 12.7,16.7 Q4.2
$1N904: length 30.3
  Bottom Layer w1.27: 10.54,24.26 10.54,28.3 10.46,28.38 ; 10.54,24.26 D4.2 ; 10.54,24.26 16.29,18.5 Q4.1 ; U9.2 8.91,28.07 10.14,28.07 10.46,28.38 ; 10.46,28.38 U8.1
$1N911: length 46
  Bottom Layer w1.27: D4.1 16.64,28.34 U9.1 36.32,48.03 36.32,62.1
$1N915: length 107.6
  Bottom Layer w1.27: 19.06,43.08 19.08,43.05 NOREF#2.1 ; 19.06,43.08 U10.1 17.78,41.91 14.73,38.86 10.43,38.86 U8.2 ; 19.06,43.08 22.61,46.63 22.61,53.47 31.24,62.1 ; NOREF#5.2 39.09,43.05 31.85,35.81 U4.2 25.15,30.9 25.15,20.45 29.34,16.26 Q2.3 ; Q4.3 6.86,16.76 3.56,20.07 3.56,35.56 7.11,35.56
$1N1323: length 64.8
  Bottom Layer w1.27: U13.1 21.68,77.99 NTC.2 24.21,79.8 31.5,72.52 50.67,72.52 52.83,74.68 66.8,74.68 69.34,72.14 69.34,62.1
$1N1552: length 6.6
  Bottom Layer w0.9: U14.2 24.09,89.83 22.48,91.44 Q5.2
$1N1627: length 13.6
  Bottom Layer w0.9: Q5.1 19.42,93.22 14.1,93.22 10.29,89.41 U15.2
$1N2099: length 11.8
  Bottom Layer w1.27: D5.1 112.44,55.76 U19.2 117.91,54.72 D6.1
$1N2104: length 16.2
  Bottom Layer w1.27: U20.1 117.02,92.32 117.02,88.8 ; 117.02,88.8 113.61,88.8 111.68,86.87 D7.2 ; 117.02,88.8 D8.2
$1N2266: length 34.5
  Bottom Layer w1.27: R1.3 103.96,53.75 U19.1
$1N2327: length 62
  Bottom Layer w1.177: R1.2 101.42,83.13 103.06,84.77 U21.1
  Bottom Layer w1.27: R1.2 101.42,69.79 97.66,66.04 83.57,66.04 75.69,58.17 68.45,58.17 66.8,59.82 66.8,62.1

## Text on the board
Top Silkscreen Layer: BAT+ | BAT- | INVERTER | Intelligent / PowerStation
